# EAGLE design 1Bitsy (EAGLE 7.7.0)
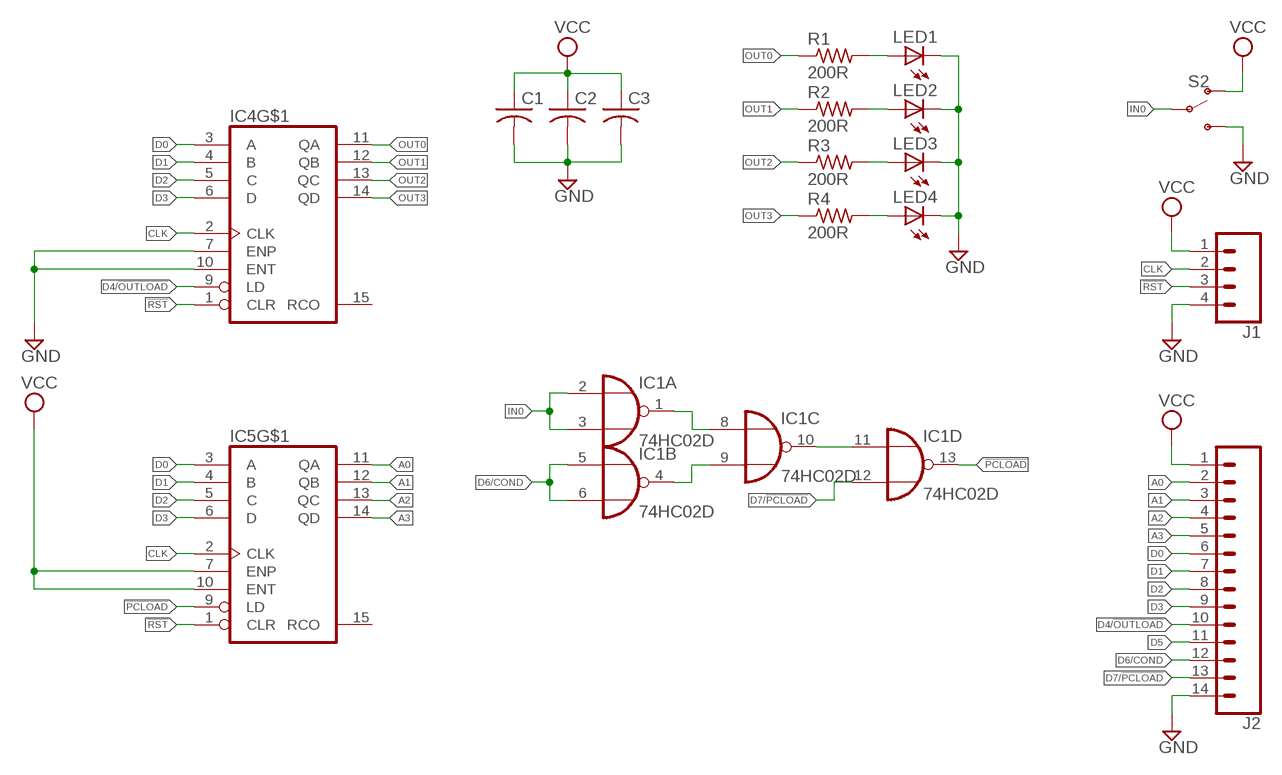
[diagram p0: schematic, sheet 1]

## Parts
C1  C-USC0805  [C0805]
C2  C-USC0805  [C0805]
C3  C-USC0805  [C0805]
IC1  74HC02D  [SO14]
IC4  74HC161  [SO16]
IC5  74HC161  [SO16]
J1  CONN_04  [1X04]
J2  CONN_14  [1X14]
LED1  LEDCHIP-LED0805  [CHIP-LED0805]
LED2  LEDCHIP-LED0805  [CHIP-LED0805]
LED3  LEDCHIP-LED0805  [CHIP-LED0805]
LED4  LEDCHIP-LED0805  [CHIP-LED0805]
R1  200R  R-US_R0805  [R0805]
R2  200R  R-US_R0805  [R0805]
R3  200R  R-US_R0805  [R0805]
R4  200R  R-US_R0805  [R0805]
S2  SWITCH-SPDT-SMD-RIGHT-ANGLE  [SWITCH_SPST_SMD_A]

## Nets
!PCLOAD: IC1.13(D:O) IC5.9(LD)
!RST: IC4.1(CLR) IC5.1(CLR) J1.3
A0: IC5.11(QA) J2.2
A1: IC5.12(QB) J2.3
A2: IC5.13(QC) J2.4
A3: IC5.14(QD) J2.5
CLK: IC4.2(CLK) IC5.2(CLK) J1.2
D0: IC4.3(A) IC5.3(A) J2.6
D1: IC4.4(B) IC5.4(B) J2.7
D2: IC4.5(C) IC5.5(C) J2.8
D3: IC4.6(D) IC5.6(D) J2.9
D4/!OUTLOAD: IC4.9(LD) J2.10
D5: J2.11
D6/COND: IC1.5(B:I0) IC1.6(B:I1) J2.12
D7/!PCLOAD: IC1.12(D:I1) J2.13
GND: C1.2 C2.2 C3.2 IC4.7(ENP) IC4.10(ENT) J1.4 J2.14 LED1.C LED2.C LED3.C LED4.C S2.3(S)
IN0: IC1.2(A:I0) IC1.3(A:I1) S2.2(P)
N$1: LED4.A R4.2
N$2: LED3.A R3.2
N$3: LED2.A R2.2
N$4: LED1.A R1.2
N$5: IC1.10(C:O) IC1.11(D:I0)
N$8: IC1.1(A:O) IC1.8(C:I0)
N$9: IC1.4(B:O) IC1.9(C:I1)
OUT0: IC4.11(QA) R1.1
OUT1: IC4.12(QB) R2.1
OUT2: IC4.13(QC) R3.1
OUT3: IC4.14(QD) R4.1
VCC: C1.1 C2.1 C3.1 IC5.7(ENP) IC5.10(ENT) J1.1 J2.1 S2.1(O)
Unconnected: IC4.15(RCO) IC5.15(RCO)

## Power pins joined to a net without a drawn wire
GND: IC1.7(P:GND) IC4.8(P:GND) IC5.8(P:GND)
VCC: IC1.14(P:VCC) IC4.16(P:VCC) IC5.16(P:VCC)

## Library data of the parts
C1-C3 = adafruit:C-US: CAPACITOR, American symbol
IC1 = 74xx-eu:74*02: Quad 2-input NOR gate
IC4 IC5 = StuffLabs:74*161
J1 = SparkFun-Connectors:CONN_04: Multi connection point. Often used as Generic Header-pin footprint for 0.1 inch spaced/style header connections On any of the 0.1 inch spaced packages, you can populate with these: Break Away Headers - Straight <https://www.sparkfun.com/products/116> (PRT-00116) Break Away Male Headers - Right Angle <https://www.sparkfun.com/products/553> (PRT-00553) Female Headers <https://www.sparkfun.com/products/115> (PRT-00115) Break Away Headers - Machine Pin <https://www.sparkfun.com/products/117> (PRT-00117) Break Away Female Headers - Swiss Machine Pin <https://www.sparkfun.com/products/743> (PRT-00743) For SCREWTERMINALS and SPRING TERMINALS visit here: Screw Terimnals on SparkFun.com <https://www.sparkfun.com/search/results?term=Screw+Terminals> (5mm/3.5mm/2.54mm spacing) This device is also useful as a general connection point to wire up your design to another part of your project. Our various solder wires solder well into these plated through hole pads. Hook-Up Wire - Assortment (Stranded, 22 AWG) <https://www.sparkfun.com/products/11375> (PRT-11375) Hook-Up Wire - Assortment (Solid Core, 22 AWG) <https://www.sparkfun.com/products/11367> (PRT-11367) View the entire wire category on our website here <https://www.sparkfun.com/categories/141> Special notes: Molex polarized connector foot print use with SKU : PRT-08231 with associated crimp pins and housings. 1MM SMD Version SKU: PRT-10208; PROD_ID: CONN-09696
J2 = SparkFun-Connectors:CONN_14: Multi connection point. Often used as Generic Header-pin footprint for 0.1 inch spaced/style header connections On any of the 0.1 inch spaced packages, you can populate with these: Break Away Headers - Straight <https://www.sparkfun.com/products/116> (PRT-00116) Break Away Male Headers - Right Angle <https://www.sparkfun.com/products/553> (PRT-00553) Female Headers <https://www.sparkfun.com/products/115> (PRT-00115) Break Away Headers - Machine Pin <https://www.sparkfun.com/products/117> (PRT-00117) Break Away Female Headers - Swiss Machine Pin <https://www.sparkfun.com/products/743> (PRT-00743) For SCREWTERMINALS and SPRING TERMINALS visit here: Screw Terimnals on SparkFun.com <https://www.sparkfun.com/search/results?term=Screw+Terminals> (5mm/3.5mm/2.54mm spacing) This device is also useful as a general connection point to wire up your design to another part of your project. Our various solder wires solder well into these plated through hole pads. Hook-Up Wire - Assortment (Stranded, 22 AWG) <https://www.sparkfun.com/products/11375> (PRT-11375) Hook-Up Wire - Assortment (Solid Core, 22 AWG) <https://www.sparkfun.com/products/11367> (PRT-11367) View the entire wire category on our website here <https://www.sparkfun.com/categories/141> Special notes: Molex polarized connector foot print use with SKU : PRT-08231 with associated crimp pins and housings. 1MM SMD Version SKU: PRT-10208 NOTES ON THE VARIANTS LOCK and LOCK_LONGPADS... This footprint was designed to help hold the alignment of a through-hole component (i.e. 6-pin header) while soldering it into place. You may notice that each hole has been shifted either up or down by 0.005 of an inch from it's more standard position (which is a perfectly straight line). This slight alteration caused the pins (the squares in the middle) to touch the edges of the holes. Because they are alternating, it causes a "brace" to hold the component in place. 0.005 has proven to be the perfect amount of "off-center" position when using our standard breakaway headers. Although looks a little odd when you look at the bare footprint, once you have a header in there, the alteration is very hard to notice. Also,if you push a header all the way into place, it is covered up entirely on the bottom side.
LED1-LED4 = adafruit:LED: LED OSRAM: - CHIPLED LG R971, LG N971, LY N971, LG Q971, LY Q971, LO R971, LY R971 LH N974, LH R974 LS Q976, LO Q976, LY Q976 LO Q996 - Hyper CHIPLED LW Q18S LB Q993, LB Q99A, LB R99A - SideLED LS A670, LO A670, LY A670, LG A670, LP A670 LB A673, LV A673, LT A673, LW A673 LH A674 LY A675 LS A676, LA A676, LO A676, LY A676, LW A676 LS A679, LY A679, LG A679 - Hyper Micro SIDELED® LS Y876, LA Y876, LO Y876, LY Y876 LT Y87S - SmartLED LW L88C, LW L88S LB L89C, LB L89S, LG L890 LS L89K, LO L89K, LY L89K LS L896, LA L896, LO L896, LY L896 - TOPLED LS T670, LO T670, LY T670, LG T670, LP T670 LSG T670, LSP T670, LSY T670, LOP T670, LYG T670 LG T671, LOG T671, LSG T671 LB T673, LV T673, LT T673, LW T673 LH T674 LS T676, LA T676, LO T676, LY T676, LB T676, LH T676, LSB T676, LW T676 LB T67C, LV T67C, LT T67C, LS T67K, LO T67K, LY T67K, LW E67C LS E67B, LA E67B, LO E67B, LY E67B, LB E67C, LV E67C, LT E67C LW T67C LS T679, LY T679, LG T679 LS T770, LO T770, LY T770, LG T770, LP T770 LB T773, LV T773, LT T773, LW T773 LH T774 LS E675, LA E675, LY E675, LS T675 LS T776, LA T776, LO T776, LY T776, LB T776 LHGB T686 LT T68C, LB T68C - Hyper Mini TOPLED® LB M676 - Mini TOPLED Santana® LG M470 LS M47K, LO M47K, LY M47K Source: http://www.osram.convergy.de/
R1-R4 = adafruit:R-US_: RESISTOR, American symbol
S2 = SparkFun-Switches:SWITCH-SPDT: Single Pole, Double Throw (SPDT) Switch Single-pole, double-throw (SPDT) switch. Variant Overview SMD-AYZ0202 Surface Mount DPDT Switch <https://www.sparkfun.com/products/597> (COM-00597) Used on e.g. LilyPad Arduino USB - ATmega32U4 Board <https://www.sparkfun.com/products/12049> PTH-11.6X4.0MM SPDT Mini Power Switch <https://www.sparkfun.com/products/102> (COM-00102) Used on e.g. SparkFun Simon Says - Through-Hole Soldering Kit <https://www.sparkfun.com/products/10547> (KIT-10547) PTH-11.6X4.0MM-KIT KIT version of SPDT Mini Power Switch - Simplifies soldering by removing tStop of switch pins - only one side can be soldered. PTH-11.6X4.0MM-LOCK LOCK version of SPDT Mini Power Switch - Offset pins hold switch in place for easier soldering. SMD-RIGHT-ANGLE Surface Mount Right Angle Switch <https://www.sparkfun.com/products/10860> (COM-10860) Used on e.g. SparkFun ESP8266 Thing <https://www.sparkfun.com/products/13231>; PROD_ID: SWCH-10651; SF_SKU: COM-10860

## Board
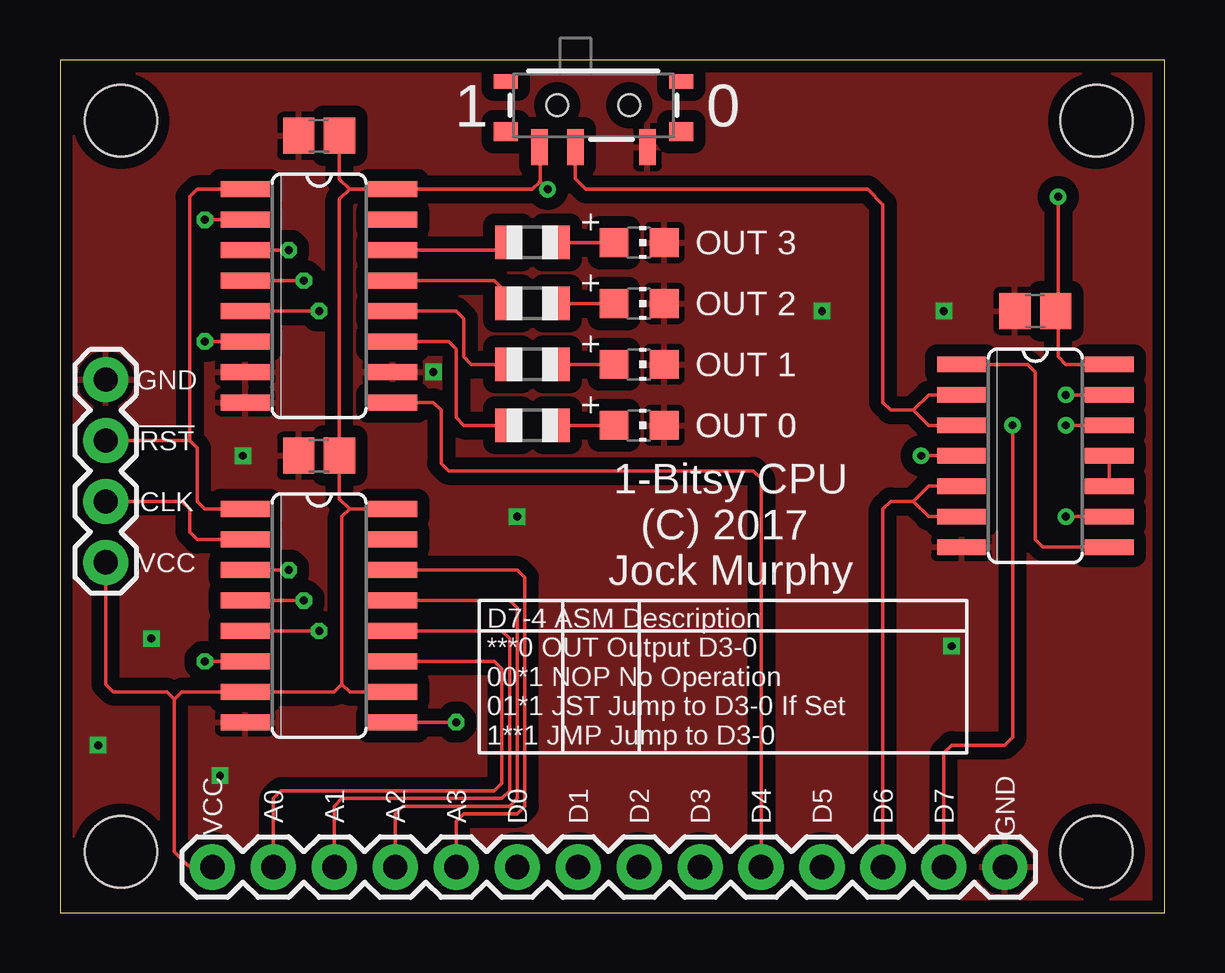
[diagram p1: board, top side]
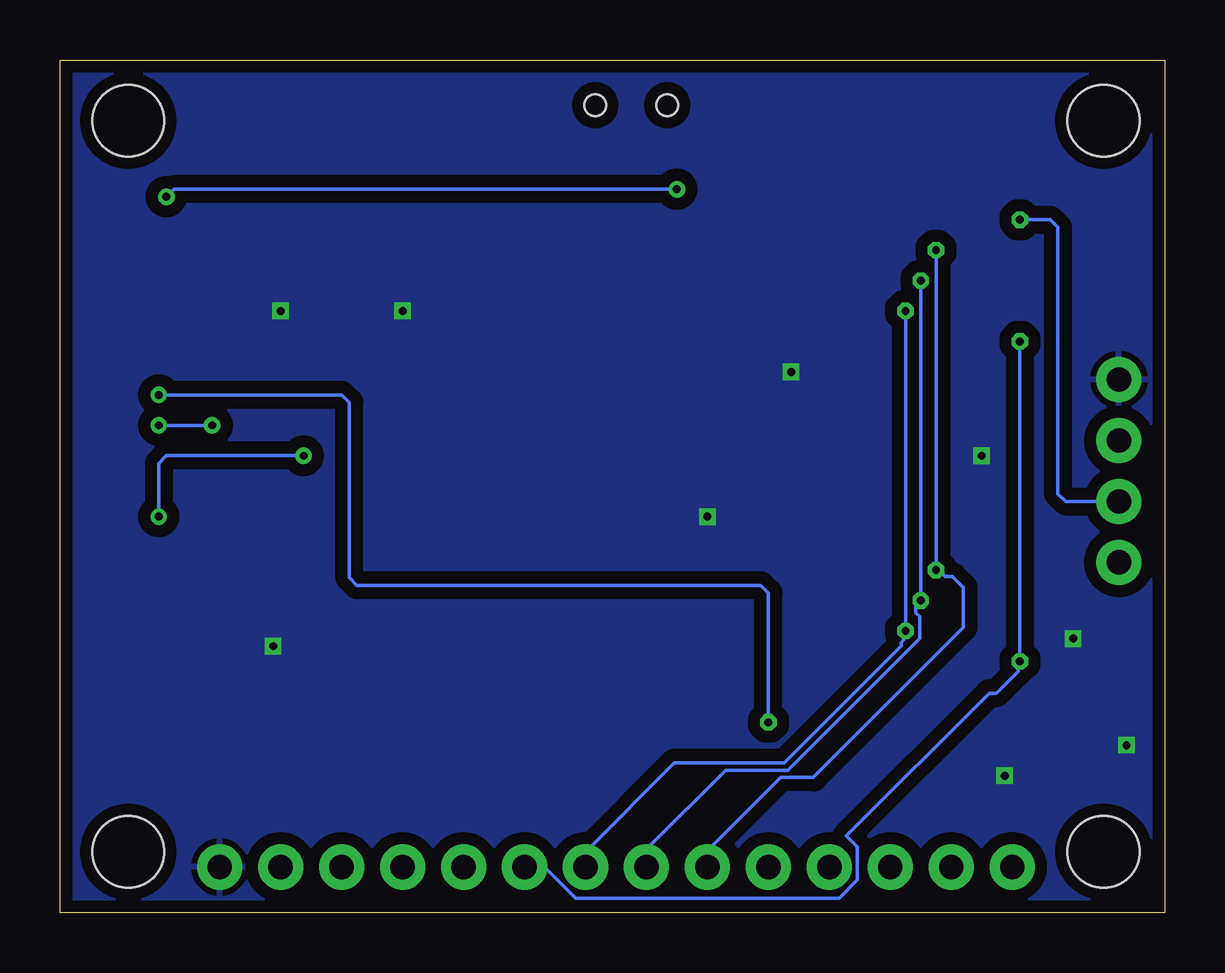
[diagram p2: board, bottom side, seen from below]

Size 46.02 x 35.55 mm. Coordinates in mm from the lower left corner, seen from the top.
Outline: 0,0 46.02,0 46.02,35.55 0,35.55 0,0
Copper layers (1*16): Top 0.0356mm / dielectric 1.5011mm / Bottom 0.0356mm
Design rules "oshpark-2layer *": minimum track width 6mil, minimum drill 13mil, track to track 6mil, track to pad 6mil, pad to pad 6mil, via to via 6mil, smd to smd 6mil, copper to edge 15mil, drill to drill 6mil, minimum pad ring 7mil, minimum via ring 7mil, stop-mask expansion 2.5mil, vias tented up to drill 25mil, thermal gap 10mil
Holes 3 mm at 2.54,2.54 43.18,2.54 43.18,33.02 2.54,33.02

### Footprints (pad centres in the part's own frame; a part is rotated, then mirrored left to right if it is on the bottom)
C0805 = smd 1.3 x 1.5: 1 -0.85,0; 2 0.85,0
SO14 = smd 0.66 x 2.032: 1 -3.81,-3.073; 2 -2.54,-3.073; 3 -1.27,-3.073; 4 0,-3.073; 5 1.27,-3.073; 6 2.54,-3.073; 7 3.81,-3.073; 8 3.81,3.073; 9 2.54,3.073; 10 1.27,3.073; 11 0,3.073; 12 -1.27,3.073; 13 -2.54,3.073; 14 -3.81,3.073
SO16 = smd 0.66 x 2.032: 1 -4.445,-3.073; 2 -3.175,-3.073; 3 -1.905,-3.073; 4 -0.635,-3.073; 5 0.635,-3.073; 6 1.905,-3.073; 7 3.175,-3.073; 8 4.445,-3.073; 9 4.445,3.073; 10 3.175,3.073; 11 1.905,3.073; 12 0.635,3.073; 13 -0.635,3.073; 14 -1.905,3.073; 15 -3.175,3.073; 16 -4.445,3.073
1X04 = drill 1.016 pad 1.88: 1 0,0; 2 2.54,0; 3 5.08,0; 4 7.62,0
1X14 = drill 1.016 pad 1.88: 1 0,0; 2 2.54,0; 3 5.08,0; 4 7.62,0; 5 10.16,0; 6 12.7,0; 7 15.24,0; 8 17.78,0; 9 20.32,0; 10 22.86,0; 11 25.4,0; 12 27.94,0; 13 30.48,0; 14 33.02,0
CHIP-LED0805 = smd 1.2 x 1.2: A 0,-1.05; C 0,1.05
R0805 = smd 1.1 x 1.4: 1 -1,0; 2 1,0
SWITCH_SPST_SMD_A = smd 0.7 x 1.5: 1 -2.25,-1.75; 2 -0.75,-1.75; 3 2.25,-1.75 | smd 1 x 0.6: GND1 -3.65,1; GND3 3.65,1 | smd 1 x 0.8: GND2 -3.65,-1.1; GND4 3.65,-1.1 | hole 0.9: -1.5,0; 1.5,0

### Placement (x,y rotation side)
C1  10.79,32.38 180 top
C2  10.79,19.05 180 top
C3  40.64,25.08 180 top
IC1  40.64,19.05 270 top
IC4  10.79,25.72 270 top
IC5  10.79,12.38 270 top
J1  1.91,14.61 90 top
J2  6.35,1.91 0 top
LED1  24.13,20.32 270 top
LED2  24.13,22.86 270 top
LED3  24.13,25.4 270 top
LED4  24.13,27.94 270 top
R1  19.68,20.32 0 top
R2  19.68,22.86 0 top
R3  19.68,25.4 0 top
R4  19.68,27.94 0 top
S2  22.23,33.66 0 top

### Tracks (layer width: path | path; a pad name or v marks a point on that pad's centre or on a via)
!PCLOAD  (via drill 0.33)
  Top 0.152: IC5.9 v16.51,7.94 | v41.91,21.59 IC1.13
  Bottom 0.152: v16.51,7.94 16.51,13.34 16.83,13.65 33.66,13.65 33.97,13.97 33.97,21.27 34.29,21.59 v41.91,21.59
!RST
  Top 0.152: IC5.1 6.03,16.83 5.71,17.14 5.71,19.37 5.4,19.68 | 5.4,19.68 J1.3 | IC4.1 5.71,30.16 5.4,29.84 5.4,19.68
A0
  Top 0.152: J2.2 8.89,4.76 9.21,5.08 18.1,5.08 18.41,5.4 18.41,10.16 18.1,10.48 IC5.11
A1
  Top 0.152: J2.3 11.43,4.45 11.75,4.76 18.41,4.76 18.73,5.08 18.73,11.43 18.41,11.75 IC5.12
A2
  Top 0.152: J2.4 13.97,4.13 14.29,4.45 18.73,4.45 19.05,4.76 19.05,12.7 18.73,13.02 IC5.13
A3
  Top 0.152: J2.5 16.51,3.81 16.83,4.13 19.05,4.13 19.37,4.45 19.37,13.97 19.05,14.29 IC5.14
CLK  (via drill 0.33)
  Top 0.152: IC5.2 5.71,15.56 5.4,15.88 5.4,16.83 5.08,17.14 J1.2 | IC4.2 v6.03,28.89
  Bottom 0.152: v6.03,28.89 4.76,28.89 4.45,28.57 4.45,17.46 4.13,17.14 J1.2
D0  (via drill 0.33)
  Top 0.152: IC4.3 v9.53,27.62 | v9.53,14.29 IC5.3
  Bottom 0.152: v9.53,27.62 v9.53,14.29 9.45,14.33 9.14,14.02 8.84,14.02 8.38,13.56 8.38,11.89 14.63,5.64 16,5.64 19.05,2.59 J2.6
D1  (via drill 0.33)
  Top 0.152: IC4.4 v10.16,26.35 | v10.16,13.02 IC5.4
  Bottom 0.152: v10.16,26.35 v10.16,13.02 10.21,12.95 10.36,12.8 10.36,12.5 10.21,12.34 10.21,11.43 15.7,5.94 18.29,5.94 21.49,2.74 21.49,1.98 J2.7
D2  (via drill 0.33)
  Top 0.152: IC4.5 v10.79,25.08 | v10.79,11.75 IC5.5
  Bottom 0.152: v10.79,25.08 v10.79,11.75 10.82,11.73 10.82,11.43 10.97,11.28 10.97,11.12 15.85,6.25 20.42,6.25 24.08,2.59 24.08,1.98 J2.8
D3  (via drill 0.33)
  Top 0.152: IC4.6 v6.03,23.81 | v6.03,10.48 IC5.6
  Bottom 0.152: v6.03,23.81 v6.03,10.48 6.1,10.36 6.1,10.06 7.01,9.14 7.32,9.14 13.26,3.2 12.8,2.74 12.8,1.37 13.56,0.61 24.54,0.61 25.76,1.83 26.67,1.83 J2.9
D4/!OUTLOAD
  Top 0.152: IC4.9 15.56,21.27 15.88,20.95 15.88,18.73 16.19,18.41 28.89,18.41 29.21,18.1 J2.10
D6/COND
  Top 0.152: J2.12 34.29,16.83 34.61,17.14 35.56,17.14 | IC1.5 36.2,17.78 35.56,17.14 | IC1.6 36.2,16.51 35.56,17.14
D7/!PCLOAD  (via drill 0.33)
  Top 0.152: J2.13 36.83,6.67 37.15,6.99 39.37,6.99 39.69,7.3 v39.69,20.32 | v41.91,20.32 IC1.12
  Bottom 0.152: v39.69,20.32 v41.91,20.32
GND  (via drill 0.33)
  other vias: 15.56,22.54 7.62,19.05 19.05,16.51 6.67,5.71 36.83,25.08 3.81,11.43 1.59,6.99 31.75,25.08 37.15,11.11
  pour Bottom (isolate 0.508): 0,35.56 46.04,35.56 46.04,0 0,0
  pour Top (isolate 0.508): 0,35.56 46.04,35.56 46.04,0 0,0
IN0
  Top 0.152: S2.2 21.48,30.59 21.91,30.16 33.66,30.16 34.29,29.53 34.29,21.27 34.61,20.95 35.56,20.95 | IC1.2 36.2,21.59 35.56,20.95 | IC1.3 36.2,20.32 35.56,20.95
N$1
  Top 0.152: R4.2 LED4.A
N$2
  Top 0.152: R3.2 LED3.A
N$3
  Top 0.152: R2.2 LED2.A
N$4
  Top 0.152: R1.2 LED1.A
N$5
  Top 0.152: IC1.11 IC1.10
N$8
  Top 0.152: IC1.1 40.32,22.86 40.64,22.54 40.64,15.56 40.96,15.24 IC1.8
N$9  (via drill 0.33)
  Top 0.152: IC1.4 v35.88,19.05 | v41.91,16.51 IC1.9
  Bottom 0.152: v35.88,19.05 41.59,19.05 41.91,18.73 v41.91,16.51
OUT0
  Top 0.152: IC4.11 16.19,23.81 16.51,23.5 16.51,20.64 16.83,20.32 R1.1
OUT1
  Top 0.152: IC4.12 16.51,25.08 16.83,24.77 16.83,23.18 17.14,22.86 R2.1
OUT2
  Top 0.152: IC4.13 18.1,26.35 19.05,25.4 R3.1
OUT3
  Top 0.152: IC4.14 18.37,27.62 R4.1
VCC  (via drill 0.33)
  Top 0.152: C1.1 11.64,30.58 12.06,30.16 | 12.06,30.16 IC4.16 19.68,30.16 19.98,30.46 | 12.06,30.16 11.64,29.74 C2.1 11.64,17.25 12.06,16.83 | 12.06,16.83 IC5.16 | J1.1 1.91,9.53 2.22,9.21 4.45,9.21 4.76,8.89 | IC5.10 12.06,9.21 11.75,9.53 | 11.75,9.53 11.75,16.51 12.06,16.83 | 11.75,9.53 11.43,9.21 IC5.7 5.08,9.21 4.76,8.89 | 5.4,1.91 5.33,1.98 | 5.33,1.98 4.76,2.54 4.76,8.89 | 19.98,30.46 20,30.48 | 20,30.48 20,31.88 S2.1 | J2.1 6.25,1.98 5.33,1.98 | 19.96,30.48 19.98,30.46 | IC1.14 41.91,22.86 41.59,23.18 41.59,24.98 C3.1 41.59,25.18 v41.59,29.84 | 20,30.48 v20.32,30.16
  Bottom 0.152: v20.32,30.16 41.27,30.16 v41.59,29.84

### Text on the board
tNames: 1 | 0 | OUT 3 | OUT 2 | OUT 1 | GND | !RST | OUT 0 | OUT 0 | CLK | 1-Bitsy CPU / (C) 2017 / Jock Murphy | VCC | D7-4 ASM Description / ***0 OUT Output D3-0 / 00*1 NOP No Operation / 01*1 JST Jump to D3-0 If Set / 1**1 JMP Jump to D3-0 | VCC | A0 | A1 | A2 | A3 | D0 | D1 | D2 | D3 | D4 | D5 | D6 | D7 | GND